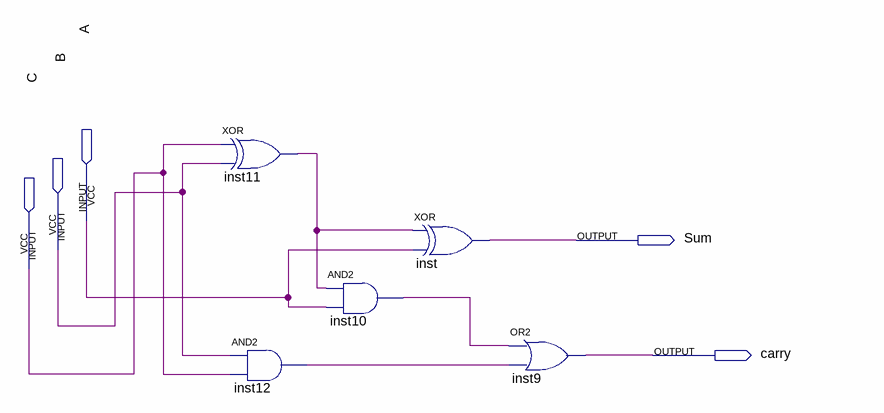
[diagram p0: schematic sheet]
// Quartus schematic Kursk.bdf as structural Verilog: 5 symbols, 5 pins
module Kursk (
  input  A,
  input  B,
  input  C,
  output Sum,
  output carry
);

  wire inst10_out, inst11_out, inst12_out;

  xor inst11 (inst11_out, C, B);
  and inst12 (inst12_out, B, C);
  and inst10 (inst10_out, inst11_out, A);
  xor inst (Sum, inst11_out, A);
  or inst9 (carry, inst10_out, inst12_out);
endmodule
